# Altium schematic sheet Board connectors.SchDoc
size A
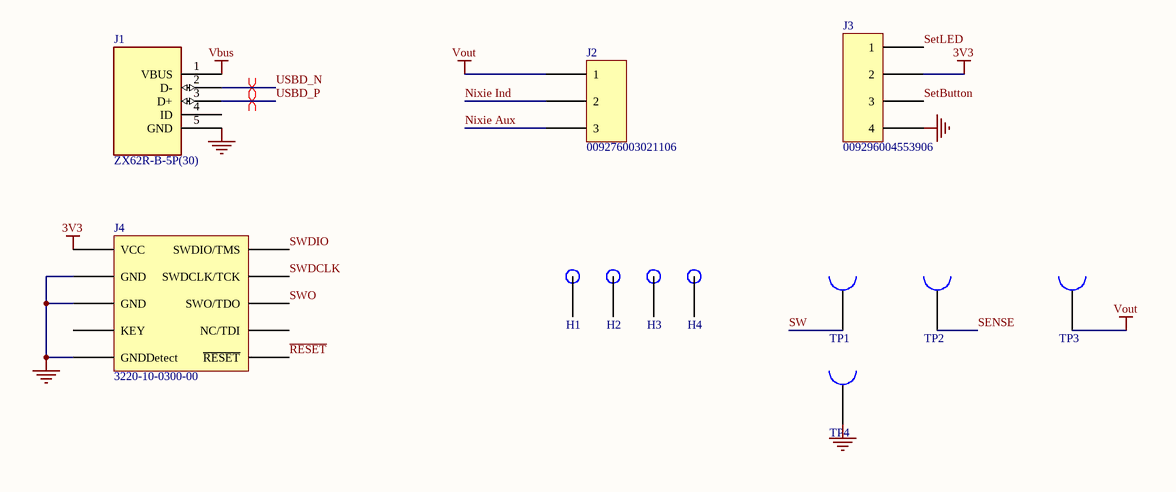
[diagram p0: Board connectors.SchDoc]

## Parts
H1  M3 PLATED TIGHT FIT PAN HEAD  [M3 PLATED TIGHT PAN HEAD]  (value not drawn)  (no BOM)
H2  M3 PLATED TIGHT FIT PAN HEAD  [M3 PLATED TIGHT PAN HEAD]  (value not drawn)  (no BOM)
H3  M3 PLATED TIGHT FIT PAN HEAD  [M3 PLATED TIGHT PAN HEAD]  (value not drawn)  (no BOM)
H4  M3 PLATED TIGHT FIT PAN HEAD  [M3 PLATED TIGHT PAN HEAD]  (value not drawn)  (no BOM)
J1  ZX62R-B-5P(30)  [HRS_ZX62R-B-5P(30)_ZX62R-B-5P(30)(Primary)]
J2  009276003021106  [009276003021106]
J3  009296004553906  [009296004553906]
J4  3220-10-0300-00  [3220-10-0300-00]
TP1  SMD test point  [2mm SMD test point]  (value not drawn)  (no BOM)
TP2  SMD test point  [2mm SMD test point]  (value not drawn)  (no BOM)
TP3  SMD test point  [2mm SMD test point]  (value not drawn)  (no BOM)
TP4  SMD test point  [2mm SMD test point]  (value not drawn)  (no BOM)

## Nets
3V3: J3.2 J4.1(VCC)
GND: J1.5(GND) J3.4 J4.3(GND) J4.5(GND) J4.9(GNDDetect) TP4.1
Vbus: J1.1(VBUS)
Vout: J2.1 TP3.1
Nixie Aux: J2.3
Nixie Ind: J2.2
~{RESET}: J4.10(~{RESET})
SENSE: TP2.1
SetButton: J3.3
SetLED: J3.1
SW: TP1.1
SWDCLK: J4.4(SWDCLK/TCK)
SWDIO: J4.2(SWDIO/TMS)
SWO: J4.6(SWO/TDO)
USBD_N: J1.2(D-)
USBD_P: J1.3(D+)

Not connected (* = marked no-connect by the designer): H1 1; H2 1; H3 1; H4 1; J1 4(ID); J4 7(KEY) 8(NC/TDI)

## Layout directives
differential pair: USBD_N, USBD_P

## Library data of the parts
H1-H4 = M3 PLATED TIGHT FIT PAN HEAD: M3 x 0.5mm plated tight fit pan head
J1 = ZX62R-B-5P(30): HIROSE(HRS)         ZX62R-B-5P(30)             USB Connector, Micro USB Type B, USB 2.0, Receptacle, 5 Ways, Surface Mount, Right Angle; Number of Contacts: 5; USB Standard: USB 2.0; Supplier 1: Digi-Key; Manufacturer: Hirose; Manufacturer Part Number: ZX62R-B-5P(30); Stock 1: 50674; Pricing 1: 1=1.02, 10=0.898, 25=0.8448, 50=0.8096, 100=0.7744, 250=0.704, 500=0.6336, 1000=0.5632 (USD); Mount: Horizontal,Surface Mount; Contact Material: Copper Alloy; Contact Plating: Gold; Packaging: Tape and Reel; Connector Type: USB; Gender: Receptacle; Orientation: Right Angle; REACH SVHC: Unknown; Lead Free: Lead Free; Supplier Part Number 1: H125274CT-ND
J2 = 009276003021106: CONN TERM BLOCK 3 POS WTB; Manufacturer: Kyocera; Number of Contacts: 3; Voltage Rating: 250V; Current: 6A; Number of Levels: 1; Gender: Receptacle; Pitch: 2.5mm; Wire Gauge (Max): 24AWG; Wire Gauge (Min): 18AWG; Supplier 1: Digi-Key; Manufacturer Part Number: 009276003021106; Stock 1: 0; Mount: Surface Mount,Through Hole; Housing Colour: White; Contact Material: Copper,Copper Alloy; Contact Plating: Tin; Housing Material: Nylon; Colour: White; Min Operating Temperature: -40°C; Max Operating Temperature: 125°C; Number of Rows: 1; Termination: Solder; Orientation: Right Angle; Packaging: Tape and Reel; Package Quantity: 1; Number of Positions: 3; Voltage: 250V; Number of Positions Per Level: 3; Number of Circuits: 3; Max Supply Voltage (AC): 250V; Max Voltage Rating (AC): 250V; Length: 9mm; Height: 5mm; Depth: 9mm; Width: 7.5mm; Radiation Hardening: No; REACH SVHC: No SVHC; Lead Free: Lead Free; ComponentLink1URL: https://media.digikey.com/pdf/Data%20Sheets/AVX%20PDFs/00927600x021x06_Spec.PDF; ComponentLink1Description: https://media.digikey.com/pdf/Data%20Sheets/AVX%20PDFs/00927600x021x06_Spec.PDF; ComponentLink2URL: http://www.farnell.com/datasheets/2003050.pdf; ComponentLink2Description: http://www.farnell.com/datasheets/2003050.pdf; ComponentLink3URL: http://www.avx.com/docs/Catalogs/9276.pdf; ComponentLink3Description: http://www.avx.com/docs/Catalogs/9276.pdf; ComponentLink4URL: //media.digikey.com/pdf/Data%20Sheets/AVX%20PDFs/00927600x021x06_Spec.PDF; ComponentLink4Description: //media.digikey.com/pdf/Data%20Sheets/AVX%20PDFs/00927600x021x06_Spec.PDF; Supplier Part Number 1: 478-6170-1-ND
J3 = 009296004553906: Headers & Wire Housings 4WAY POKE HOME VERTICAL TOP MOUNT; Manufacturer: Kyocera AVX; Voltage Rating: 200V; Current Rating: 7A; Number of Positions: 4; Connector Type: Poke-In; Wire Gauge (Max): 26AWG; Wire Gauge (Min): 18AWG; Pitch: 4mm; Cable Pitch: 0.157inch; Supplier 1: Digi-Key; Manufacturer Part Number: 009296004553906; Stock 1: 2302; Pricing 1: 1=1.2, 10=1.057, 100=0.9123 (USD); Mount: Surface Mount; Colour: White; Contact Material: Copper Alloy; Contact Plating: Tin; Housing Material: Nylon; Min Operating Temperature: -40°C; Max Operating Temperature: 125°C; Packaging: Tape and Reel; Package Quantity: 400; Termination: SMD/SMT; Number of Rows: 1; Contact Gender: Female; Wire/Cable Gauge: 18AWG; Lead Free: Lead Free; Flammability Rating: UL94 V-0; ComponentLink1URL: http://datasheets.avx.com/PokeHomeVerticalTop_00-9296.pdf; ComponentLink1Description: http://datasheets.avx.com/PokeHomeVerticalTop_00-9296.pdf; Supplier Part Number 1: 478-9323-1-ND
J4 = 3220-10-0300-00: IDC BOX HEADER 0.050 10 POS; Manufacturer: CNC Tech; Number of Positions: 10; Connector Type: Male Pin; Pitch: 0.05inch; Supplier 1: Digi-Key; Manufacturer Part Number: 3220-10-0300-00; Stock 1: 193314; Pricing 1: 1=0.74, 10=0.69, 100=0.529, 500=0.46, 3200=0.345, 6400=0.3335, 12800=0.3059 (USD); Mount: Surface Mount; Contact Plating: Gold; Package Quantity: 3200; Number of Rows: 2; Packaging: Tray; Termination: Solder; Row Spacing: 0.05inch; ComponentLink1URL: http://cnctech.us/idcmatching2.pdf; ComponentLink1Description: http://cnctech.us/idcmatching2.pdf; Supplier Part Number 1: 1175-1629-ND